# Altium schematic sheet led.SchDoc
size A4
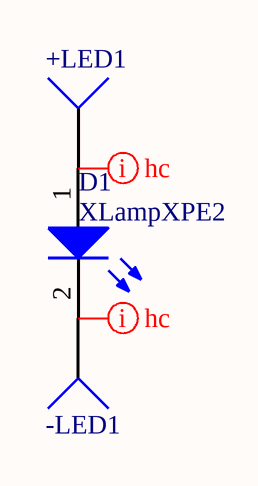
[diagram p0: led.SchDoc]

## Parts
+LED1  +LED  [PIN1L]  (value not drawn)
-LED1  -LED  [PIN1L]  (value not drawn)
D1  XLampXPE2  [XLAMP]

## Nets
Net+LED1_1: +LED1.1 D1.1(A)
Net-LED1_1: -LED1.1 D1.2(K)

## Layout directives
net class hc: Net+LED1_1, Net-LED1_1

## Library data of the parts
+LED1 -LED1 = Socket: LatestRevisionDate: 17-Jul-2002; LatestRevisionNote: Re-released for DXP Platform.; Publisher: Altium Limited
D1 = LED0: Typical INFRARED GaAs LED; Published: 8-Jun-2000; LatestRevisionDate: 08-Jul-2005; LatestRevisionNote: Mech Layer 1 removed.; PackageReference: LED-0; Publisher: Altium Limited; PackageDescription: LED; 2 Leads